# Altium schematic sheet MiniPrinter1.0.SchDoc
size A3
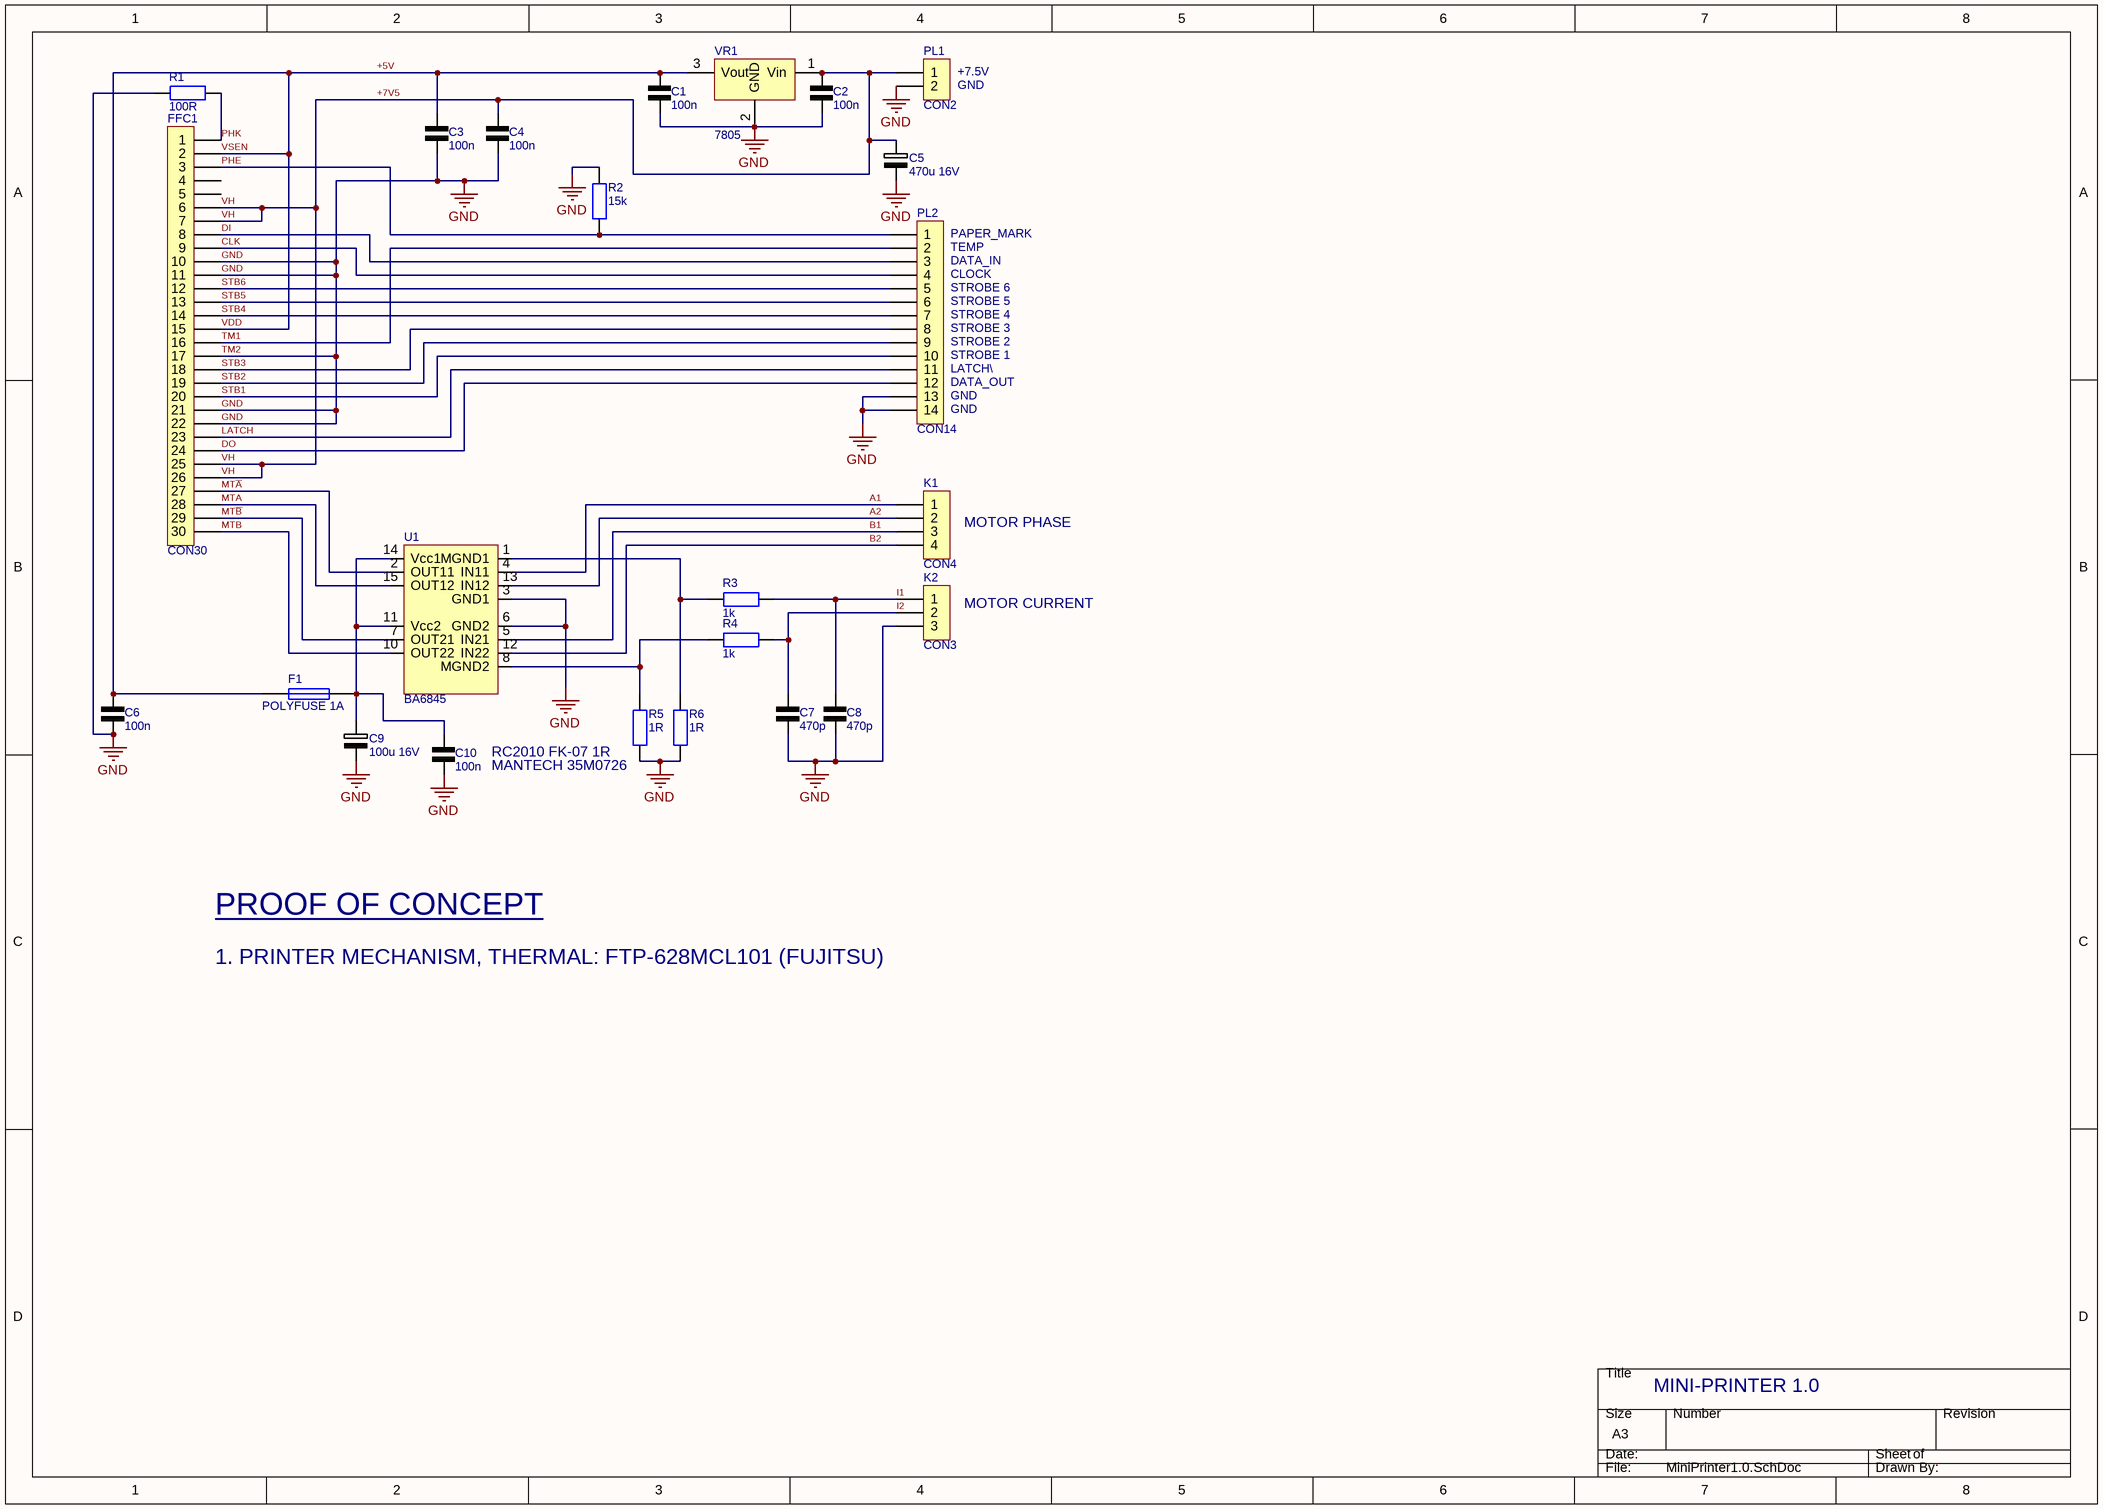
[diagram p0: MiniPrinter1.0.SchDoc]

## Parts
C1  100n  [SM 0805]
C2  100n  [SM 0805]
C3  100n  [SM 0805]
C4  100n  [SM 0805]
C5  470u 16V  [CAP RADIAL 5/13]
C6  100n  [SM 0805]
C7  470p  [SM 0603]
C8  470p  [SM 0603]
C9  100u 16V  [CAP RADIAL 2.5/6]
C10  100n  [SM 0805]
F1  POLYFUSE 1A  [MSF110]
FFC1  CON30  [FFC30-1.0-TH-ZIF]
K1  CON4  [SIL4]
K2  CON3  [SIL3]
PL1  CON2  [DG127-5.0-2]
PL2  CON14  [SIL14]
R1  100R  [SM 0805]
R2  15k  [SM 0805]
R3  1k  [SM 1206]
R4  1k  [SM 1206]
R5  1R  [RES 1/4W H]
R6  1R  [RES 1/4W H]
U1  BA6845  [SSOP-A16 (ROHM)]
VR1  7805  [TO-220V]

## Nets
GND: C1.2 C2.2 C3.2 C4.2 C5.2 C6.2 C7.2 C8.2 C9.2 C10.2 FFC1.10 FFC1.11 FFC1.17 FFC1.21 FFC1.22 K2.3 PL1.2 PL2.13 PL2.14 R1.2 R2.2 R5.1 R6.1 U1.3(GND1) U1.6(GND2) VR1.2(GND)  [also labelled TM2]
+5V: C1.1 C3.1 C6.1 F1.1 FFC1.2 FFC1.15 VR1.3(Vout)  [also labelled VDD, VSEN]
+7V5: C2.1 C4.1 C5.1 FFC1.6 FFC1.7 FFC1.25 FFC1.26 PL1.1 VR1.1(Vin)  [also labelled VH]
A1: K1.1 U1.4(IN11)
A2: K1.2 U1.13(IN12)
B1: K1.3 U1.5(IN21)
B2: K1.4 U1.12(IN22)
CLK: FFC1.9 PL2.4
DI: FFC1.8 PL2.3
DO: FFC1.24 PL2.12
I1: C8.1 K2.1 R3.2
I2: C7.1 K2.2 R4.2
LATCH: FFC1.23 PL2.11
MTA: FFC1.28 U1.15(OUT12)
MT~{A}: FFC1.27 U1.2(OUT11)
MTB: FFC1.30 U1.10(OUT22)
MT~{B}: FFC1.29 U1.7(OUT21)
PHE: FFC1.3 PL2.1 R2.1
PHK: FFC1.1 R1.1
STB1: FFC1.20 PL2.10
STB2: FFC1.19 PL2.9
STB3: FFC1.18 PL2.8
STB4: FFC1.14 PL2.7
STB5: FFC1.13 PL2.6
STB6: FFC1.12 PL2.5
TM1: FFC1.16 PL2.2
NetC9_1: C9.1 C10.1 F1.2 U1.11(Vcc2) U1.14(Vcc1)
NetR3_1: R3.1 R6.2 U1.1(MGND1)
NetR4_1: R4.1 R5.2 U1.8(MGND2)

Not connected (* = marked no-connect by the designer): FFC1 4 5; U1 9(NC) 16(NC)

## Notes on the sheet
- (near PL1) +7.5V
- (near PL1) GND
- (near PL2) PAPER_MARK
- (near PL2) TEMP
- (near PL2) DATA_IN
- (near PL2) CLOCK
- (near PL2) STROBE 6
- (near PL2) STROBE 5
- (near PL2) STROBE 4
- (near PL2) STROBE 3
- (near PL2) STROBE 2
- (near PL2) STROBE 1
- (near PL2) LATCH\
- (near PL2) DATA_OUT
- (near PL2) GND
- (near K1) MOTOR PHASE
- (near K2) MOTOR CURRENT
- RC2010 FK-07 1R
- MANTECH 35M0726
- PROOF OF CONCEPT
- 1. PRINTER MECHANISM, THERMAL: FTP-628MCL101 (FUJITSU)
- MINI-PRINTER 1.0

## Library data of the parts
C1-C4 C6-C8 C10 = CAPACITOR
C5 C9 = POL_CAP
F1 = FUSE: SAP Code: *; 1st Manf.: *; 1st Manf. Part #: *; 1st Manf. Package type: *; 1st Vendor: *; 1st Vendor Part #: *; 1st Vendor Leadtime: *; 1st Vendor Standard Cost: *; 2nd Manf.: *; 2nd Manf. Part #: *; 2nd Manf. Package type: *; 2nd Vendor: *; 2nd Vendor Part #: *; 2nd Vendor Leadtime: *; 2nd Vendor Standard Cost: *; *: *
K1 = CON4: 4 Way Connector; SAP Code: *; 1st Manf.: *; 1st Manf. Part #: *; 1st Manf. Package type: *; 1st Vendor: *; 1st Vendor Part #: *; 1st Vendor Leadtime: *; 1st Vendor Standard Cost: *; 2nd Manf.: *; 2nd Manf. Part #: *; 2nd Manf. Package type: *; 2nd Vendor: *; 2nd Vendor Part #: *; 2nd Vendor Leadtime: *; 2nd Vendor Standard Cost: *; *: *
K2 = CON3: 3 Way Connector; SAP Code: *; 1st Manf.: *; 1st Manf. Part #: *; 1st Manf. Package type: *; 1st Vendor: *; 1st Vendor Part #: *; 1st Vendor Leadtime: *; 1st Vendor Standard Cost: *; 2nd Manf.: *; 2nd Manf. Part #: *; 2nd Manf. Package type: *; 2nd Vendor: *; 2nd Vendor Part #: *; 2nd Vendor Leadtime: *; 2nd Vendor Standard Cost: *; *: *
PL1 = CON2: 2 Way connector; SAP Code: *; 1st Manf.: *; 1st Manf. Part #: *; 1st Manf. Package type: *; 1st Vendor: *; 1st Vendor Part #: *; 1st Vendor Leadtime: *; 1st Vendor Standard Cost: *; 2nd Manf.: *; 2nd Manf. Part #: *; 2nd Manf. Package type: *; 2nd Vendor: *; 2nd Vendor Part #: *; 2nd Vendor Leadtime: *; 2nd Vendor Standard Cost: *; *: *
PL2 = CON14: 14 Way Connector; SAP Code: *; 1st Manf.: *; 1st Manf. Part #: *; 1st Manf. Package type: *; 1st Vendor: *; 1st Vendor Part #: *; 1st Vendor Leadtime: *; 1st Vendor Standard Cost: *; 2nd Manf.: *; 2nd Manf. Part #: *; 2nd Manf. Package type: *; 2nd Vendor: *; 2nd Vendor Part #: *; 2nd Vendor Leadtime: *; 2nd Vendor Standard Cost: *; *: *
R1-R6 = RES
VR1 = REG 78XX: Fixed voltage regulator; SAP Code: *; 1st Manf.: *; 1st Manf. Part #: *; 1st Manf. Package type: *; 1st Vendor: *; 1st Vendor Part #: *; 1st Vendor Leadtime: *; 1st Vendor Standard Cost: *; 2nd Manf.: *; 2nd Manf. Part #: *; 2nd Manf. Package type: *; 2nd Vendor: *; 2nd Vendor Part #: *; 2nd Vendor Leadtime: *; 2nd Vendor Standard Cost: *; *: *